# Altium schematic sheet Section Three.SchDoc
size A4; Organization: BrickRed Systems; Address1: 2509 152nd Ave NE; Address2: Suite B; Address3: Redmond, WA 98052; SheetNumber: 5; SheetTotal: 6
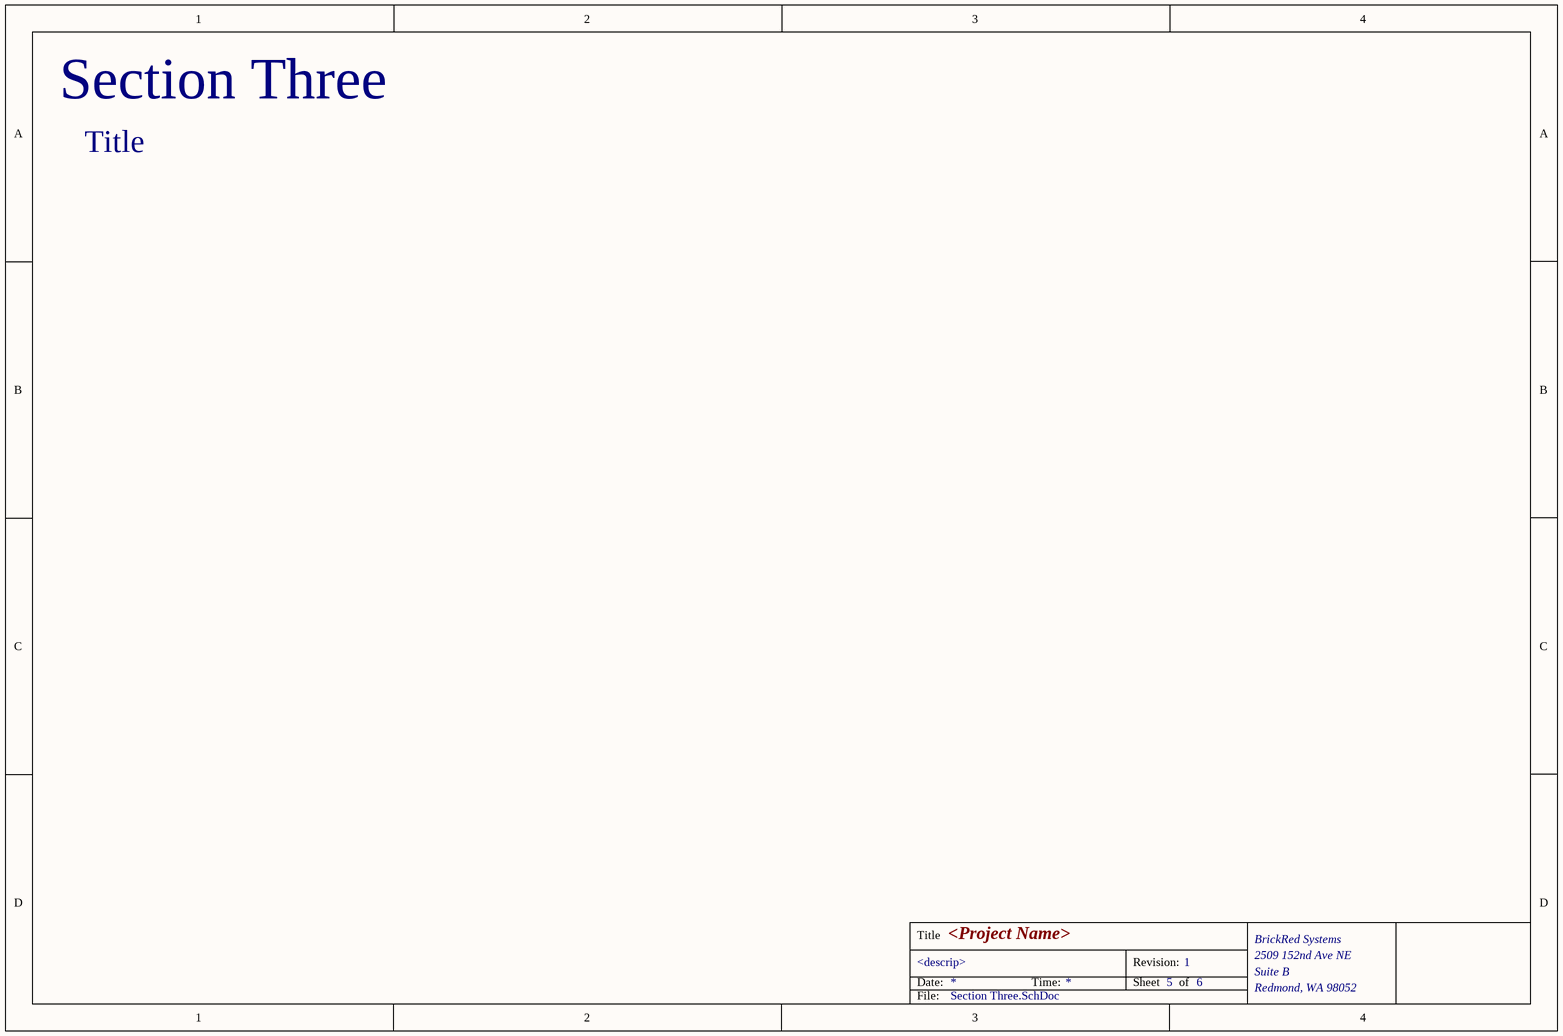
[diagram p0: Section Three.SchDoc]

## Notes on the sheet
- Section Three
- Title
- Date:
- <descrip>
- <Project Name>
- Time:
- Revision:
- Sheet
- of
- 1
- File: